# Altium schematic sheet 4_Sheet1.SchDoc
size A3
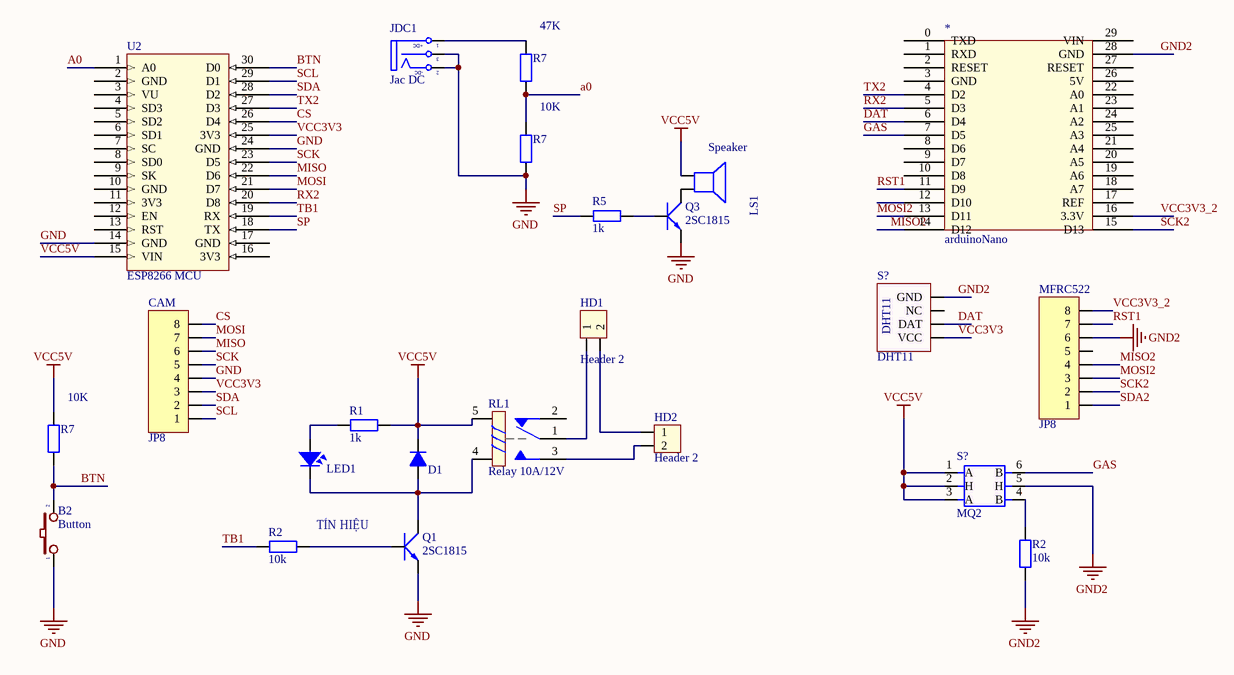
[diagram p0: 4_Sheet1.SchDoc]

## Parts
(Parts that share a designator on the sheet are numbered #1, #2 ... from top to bottom, then left to right.)
*  arduinoNano  [Arduino nano]
B2  Button  [Button2]
CAM  JP8  [JP8-C1T]
D1  Diode  [DIO-1A]  (value not drawn)
HD1  Header 2  [HED2]
HD2  Header 2  [HED2]
JDC1  Jac DC  [DC0]
LED1  LED  [LED-5-RED]  (value not drawn)
LS1  Speaker  [SPEAKER]
MFRC522  JP8  [JP8-C1T]
Q1  2SC1815  [TO92-123]
Q3  2SC1815  [TO92-123]
R1  1k  [R1/4W]
R2#1  10k  [R1/4W]
R2#2  10k  [R1/4W]
R5  1k  [R1/4W]
R7#1  value 47K  [R1/4W]  (hidden comment: 1k)
R7#2  value 10K  [R1/4W]  (hidden comment: 1k)
R7#3  value 10K  [R1/4W]  (hidden comment: 1k)
RL1  Relay 10A/12V  [RELAY 5]
S?#1  DHT11  [DHT11]
S?#2  MQ2  [MQ2]
U2  ESP8266 MCU  [8266v2]

## Nets
GND: B2.1 CAM.4 JDC1.2(TN) JDC1.3(S) Q1.1(E) Q3.1(E) R7#2.1 U2.14(GND) U2.24(GND)
GND2: *.28(GND) MFRC522.6 R2#2.2 S?#1.4(GND) S?#2.5(H)
VCC5V: D1.2(K) LS1.1 R1.2 R7#3.2 RL1.5 S?#2.1(A) S?#2.2(H) S?#2.3(A) U2.15(VIN)
A0: R7#1.1 R7#2.2 U2.1(A0)
BTN: B2.2 R7#3.1 U2.30(D0)
CS: CAM.8 U2.26(D4)
DAT: *.6(D4) S?#1.2(DAT)
GAS: *.7(D5) S?#2.6(B)
MISO: CAM.6 U2.22(D6)
MISO2: *.14(D12) MFRC522.4
MOSI: CAM.7 U2.21(D7)
MOSI2: *.13(D11) MFRC522.3
RST1: *.11(D9) MFRC522.7
RX2: *.5(D3) U2.20(D8)
SCK: CAM.5 U2.23(D5)
SCK2: *.15(D13) MFRC522.2
SCL: CAM.1 U2.29(D1)
SDA: CAM.2 U2.28(D2)
SDA2: MFRC522.1
SP: R5.1 U2.18(TX)
TB1: R2#1.1 U2.19(RX)
TX2: *.4(D2) U2.27(D3)
VCC3V3: CAM.3 S?#1.1(VCC) U2.25(3V3)
VCC3V3_2: *.16(3.3V) MFRC522.8
NetD1_1: D1.1(A) LED1.2 Q1.2(C) RL1.4
NetHD1_1: HD1.1 RL1.1
NetHD1_2: HD1.2 HD2.1
NetHD2_2: HD2.2 RL1.3
NetJDC1_1: JDC1.1(T) R7#1.2
NetLED1_1: LED1.1 R1.1
NetLS1_2: LS1.2 Q3.2(C)
NetQ1_3: Q1.3(B) R2#1.2
NetQ3_3: Q3.3(B) R5.2
NetR2#2_1: R2#2.1 S?#2.4(B)

Not connected (* = marked no-connect by the designer): * 0(TXD) 1(RXD) 2(RESET) 3(GND) 8(D6) 9(D7) 10(D8) 12(D10) 17(REF) 18(A7) 19(A6) 20(A5) 21(A4) 22(A0) 23(A1) 24(A2) 25(A3) 26(5V) 27(RESET) 29(VIN); MFRC522 5; RL1 2; S?#1 3(NC); U2 2(GND) 3(VU) 4(SD3) 5(SD2) 6(SD1) 7(SC) 8(SD0) 9(SK) 10(GND) 11(3V3) 12(EN) 13(RST) 16(3V3) 17(GND)

## Notes on the sheet
- TÍN HIỆU
- Title
- Size:
- Date:
- A3
- Number:
- Time:
- Revision:
- Sheet
- of
- File:
- (in symbol DCIN) +DC; -DC

## Library data of the parts
CAM MFRC522 = JP8: WR-PHD 2.54 mm Angled Socket Header; Manufacturer: W¨¹rth Elektronik eiSos GmbH; partNo: 613008143121; ComponentLink1 Description: Manufacturer; ComponentLink2 Description: Datasheet; NoPins: 08; Created Date: 29 March 2013; ComponentLink1URL: http://www.we-online.com; ComponentLink2URL: http://katalog.we-online.de/em/datasheet/6130xx143121.pdf; Created by: Karrer Zheng
D1 = Diode: Default Diode; Code - JEDEC: DO-214-AB; Value: 1N5007; Published: 8-Jun-2000; Revision: July-2002: Re-released for DXP Platform.; Publisher: Altium Limited
HD1 HD2 = Hed2: Header 2 (Green); Value: Header 2
JDC1 = DCIN: Jac DC input; Value: Jac DC
LED1 = LED: LED Single colour Green and Red; Value: LED 3 ly Single Colour
LS1 = Speaker: Loudspeaker; Published: 24-Mar-1999; LatestRevisionDate: 17-Jul-2002; LatestRevisionNote: Re-released for DXP Platform.; PackageReference: PIN2; Publisher: Altium Limited
Q1 Q3 = 2SC1815: NPN 600mW, ECB; Value: C1815
R1 R2#1 R2#2 R5 = R1/4W: Resistor 1/4W; Value: R1/4W - 1K
R7#1-R7#3 = R1/4W: Resistor 1/4W
RL1 = Relay 5: Relay SPDT,10A - 12VDC 5 Pin; Value: Relay SPDT, 10A, 12V